# Altium project MB1605.PrjPcb (part 5 of 7)

## Sheet USB3.SchDoc: USB3
size A3; Date: Not used; ApprovedBy: Not used; CheckedBy: Not used; Author: Not used; CompanyName: STMicroelectronics; DrawnBy: Not used; Engineer: Not used; Organization: Not used; Address1: Not used; Address2: Not used; Address3: Not used; Address4: Not used; DocumentNumber: Not used; Revision: Not used; SheetNumber: 13; SheetTotal: 18; CurrentTime: Not used; CurrentDate: Not used; Time: Not used; DocumentFullPathAndName: Not used; DocumentName: Not used; ModifiedDate: Not used; ImagePath: Not used; ProjectName: Not used; Application_BuildNumber: Not used
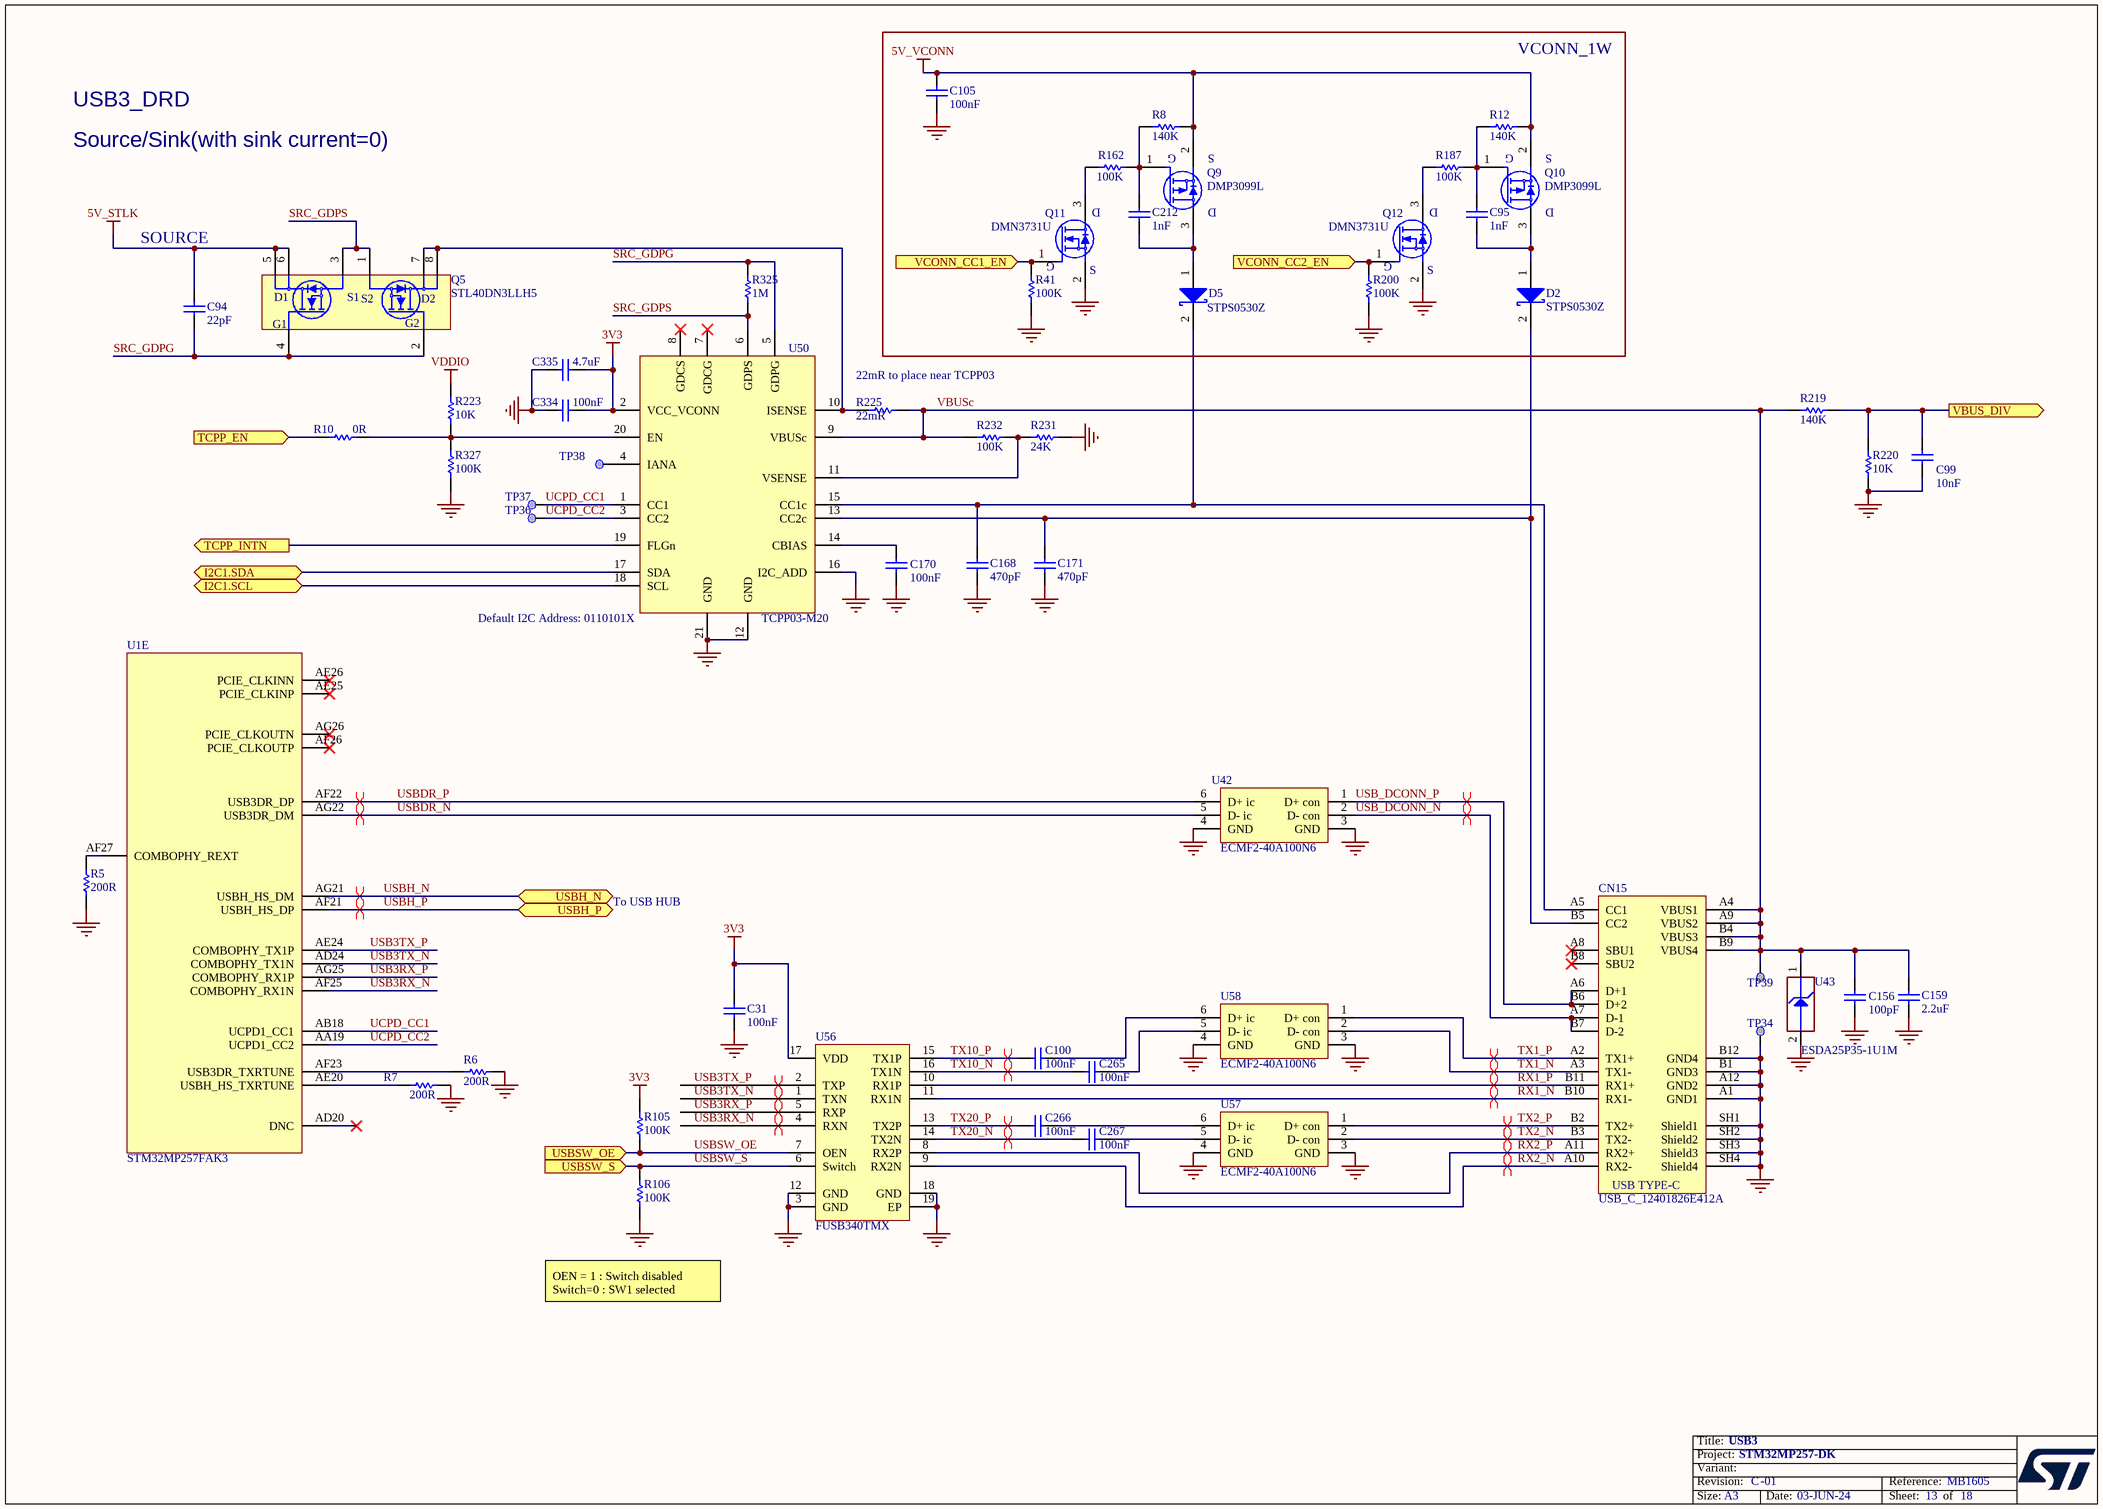
[diagram p10: USB3.SchDoc]

### Parts
C31  value 100nF  [C0402]  (hidden comment: Capacitor)
C94  value 22pF  [C0402]  (hidden comment: Capacitor)
C95  value 1nF  [C0402]  (hidden comment: Capacitor)
C99  value 10nF  [C0402]  (hidden comment: Capacitor)
C100  value 100nF  [C0201_H0P3]  (hidden comment: Capacitor)
C105  value 100nF  [C0402]  (hidden comment: Capacitor)
C156  value 100pF  [C0402]  (hidden comment: Capacitor)
C159  value 2.2uF  [C0805]  (hidden comment: Capacitor)
C168  value 470pF  [C0402]  (hidden comment: Capacitor)
C170  value 100nF  [C0603]  (hidden comment: Capacitor)
C171  value 470pF  [C0402]  (hidden comment: Capacitor)
C212  value 1nF  [C0402]  (hidden comment: Capacitor)
C265  value 100nF  [C0201_H0P3]  (hidden comment: Capacitor)
C266  value 100nF  [C0201_H0P3]  (hidden comment: Capacitor)
C267  value 100nF  [C0201_H0P3]  (hidden comment: Capacitor)
C334  value 100nF  [C0402]  (hidden comment: Capacitor)
C335  value 4.7uF  [C0402]  (hidden comment: Capacitor)
CN15  value USB_C_12401826E412A  [CON_USB-TYPEC_AMPHENOL_12401826E412A]  (hidden comment: USB_TYPE_C_Receptacle)
D2  value STPS0530Z  [DIO_SOD123_1A_2K_H1P45]  (hidden comment: SCHOTTKY_1A_2K)
D5  value STPS0530Z  [DIO_SOD123_1A_2K_H1P45]  (hidden comment: SCHOTTKY_1A_2K)
Q5  STL40DN3LLH5  [PowerFLAT_5x6]
Q9  value DMP3099L  [MOS_SOT23]  (hidden comment: MOSFET_P-CHANNEL)
Q10  value DMP3099L  [MOS_SOT23]  (hidden comment: MOSFET_P-CHANNEL)
Q11  value DMN3731U  [MOS_SOT23]  (hidden comment: MOSFET_N-CHANNEL)
Q12  value DMN3731U  [MOS_SOT23]  (hidden comment: MOSFET_N-CHANNEL)
R5  value 200R  [R0402]  (hidden comment: Resistor)
R6  value 200R  [R0402]  (hidden comment: Resistor)
R7  value 200R  [R0402]  (hidden comment: Resistor)
R8  value 140K  [R0402]  (hidden comment: Resistor)
R10  value 0R  [R0402]  (hidden comment: Resistor)
R12  value 140K  [R0402]  (hidden comment: Resistor)
R41  value 100K  [R0402]  (hidden comment: Resistor)
R105  value 100K  [R0402]  (hidden comment: Resistor)
R106  value 100K  [R0402]  (hidden comment: Resistor)
R162  value 100K  [R0402]  (hidden comment: Resistor)
R187  value 100K  [R0402]  (hidden comment: Resistor)
R200  value 100K  [R0402]  (hidden comment: Resistor)
R219  value 140K  [R0402]  (hidden comment: Resistor)
R220  value 10K  [R0402]  (hidden comment: Resistor)
R223  value 10K  [R0402]  (hidden comment: Resistor)
R225  value 22mR  [R0603]  (hidden comment: Resistor)
R231  value 24K  [R0402]  (hidden comment: Resistor)
R232  value 100K  [R0402]  (hidden comment: Resistor)
R325  value 1M  [R0402]  (hidden comment: Resistor)
R327  value 100K  [R0402]  (hidden comment: Resistor)
TP34  Test Point  [TP_SMD_1MM]  (value not drawn)  (no BOM)
TP36  Test Point  [TP_SMD_1MM]  (value not drawn)  (no BOM)
TP37  Test Point  [TP_SMD_1MM]  (value not drawn)  (no BOM)
TP38  Test Point  [TP_SMD_1MM]  (value not drawn)  (no BOM)
TP39  Test Point  [TP_SMD_1MM]  (value not drawn)  (no BOM)
U1  STM32MP257FAK3  [ICC_TFBGA424_14X14_P050_H1P20_CODE-B0A2]  (part E of 9)
U42  ECMF2-40A100N6  [ESD_UQFN-6L_1P45X1P4_P040]
U43  value ESDA25P35-1U1M  [ESD_QFN1610_2N_1K_2A]  (hidden comment: ESD-TRANSIL)
U50  TCPP03-M20  [ICC_QFN20-EPAD_4X4_P050]
U56  FUSB340TMX  [ICC_UQFN18-EPAD_2X2P80_P040]
U57  ECMF2-40A100N6  [ESD_UQFN-6L_1P45X1P4_P040]
U58  ECMF2-40A100N6  [ESD_UQFN-6L_1P45X1P4_P040]

### Blocks framed on the sheet
VCONN_1W: C95 C105 C212 D2 D5 Q9-Q12 R8 R12 R41 R162 R187 R200

### Ports
I2C1.SCL (bidir), I2C1.SDA (bidir), TCPP_EN (in), TCPP_INTN (out), USBH_N (bidir), USBH_P (bidir), USBSW_OE (in), USBSW_S (in), VBUS_DIV (out), VCONN_CC1_EN (in), VCONN_CC2_EN (in)

### Nets
3V3: C31.1 C334.1 C335.1 R105.2 U50.2(VCC_VCONN) U56.17(VDD)
5V_STLK: C94.2 Q5.5(D1) Q5.6(D1)
5V_VCONN: C105.1 Q9.2(S) Q10.2(S) R8.2 R12.2
GND: C31.2 C99.2 C105.2 C156.1 C159.1 C168.1 C170.1 C171.1 C334.2 C335.2 CN15.A1(GND1) CN15.A12(GND2) CN15.B1(GND3) CN15.B12(GND4) CN15.SH1(Shield1) CN15.SH2(Shield2) CN15.SH3(Shield3) CN15.SH4(Shield4) Q11.2(S) Q12.2(S) R5.1 R6.2 R7.2 R41.1 R106.1 R200.1 R220.1 R231.2 R327.1 TP34.1 U42.3(GND) U42.4(GND) U43.2(GND) U50.12(GND) U50.16(I2C_ADD) U50.21(GND) U56.3(GND) U56.12(GND) U56.18(GND) U56.19(EP) U57.3(GND) U57.4(GND) U58.3(GND) U58.4(GND)
VDDIO: R223.2
I2C1.SCL: U50.18(SCL) ; port I2C1.SCL
I2C1.SDA: U50.17(SDA) ; port I2C1.SDA
RX1_N: CN15.B10(RX1-) U56.11(RX1N)
RX1_P: CN15.B11(RX1+) U56.10(RX1P)
RX2_N: CN15.A10(RX2-) U56.9(RX2N)
RX2_P: CN15.A11(RX2+) U56.8(RX2P)
SRC_GDPG: C94.1 Q5.2(G2) Q5.4(G1) R325.2 U50.5(GDPG)
SRC_GDPS: Q5.1(S2) Q5.3(S1) R325.1 U50.6(GDPS)
TCPP_EN: R10.1 ; port TCPP_EN
TCPP_INTN: U50.19(FLGn) ; port TCPP_INTN
TX1_N: CN15.A3(TX1-) U58.2(D-_con)
TX1_P: CN15.A2(TX1+) U58.1(D+_con)
TX2_N: CN15.B3(TX2-) U57.2(D-_con)
TX2_P: CN15.B2(TX2+) U57.1(D+_con)
TX10_N: C265.1 U56.16(TX1N)
TX10_P: C100.1 U56.15(TX1P)
TX20_N: C267.1 U56.14(TX2N)
TX20_P: C266.1 U56.13(TX2P)
UCPD_CC1: TP37.1 U1.AB18(UCPD1_CC1) U50.1(CC1)
UCPD_CC2: TP36.1 U1.AA19(UCPD1_CC2) U50.3(CC2)
USB3RX_N: U1.AF25(COMBOPHY_RX1N) U56.4(RXN)
USB3RX_P: U1.AG25(COMBOPHY_RX1P) U56.5(RXP)
USB3TX_N: U1.AD24(COMBOPHY_TX1N) U56.1(TXN)
USB3TX_P: U1.AE24(COMBOPHY_TX1P) U56.2(TXP)
USB_DCONN_N: CN15.A7(D-1) CN15.B7(D-2) U42.2(D-_con)
USB_DCONN_P: CN15.A6(D+1) CN15.B6(D+2) U42.1(D+_con)
USBDR_N: U1.AG22(USB3DR_DM) U42.5(D-_ic)
USBDR_P: U1.AF22(USB3DR_DP) U42.6(D+_ic)
USBH_N: U1.AG21(USBH_HS_DM) ; port USBH_N
USBH_P: U1.AF21(USBH_HS_DP) ; port USBH_P
USBSW_OE: R105.1 U56.7(OEN) ; port USBSW_OE
USBSW_S: R106.2 U56.6(Switch) ; port USBSW_S
VBUS_DIV: C99.1 R219.1 R220.2 ; port VBUS_DIV
VBUSc: C156.2 C159.2 CN15.A4(VBUS1) CN15.A9(VBUS2) CN15.B4(VBUS3) CN15.B9(VBUS4) R219.2 R225.1 R232.1 TP39.1 U43.1(IO1) U50.9(VBUSc)
VCONN_CC1_EN: Q11.1(G) R41.2 ; port VCONN_CC1_EN
VCONN_CC2_EN: Q12.1(G) R200.2 ; port VCONN_CC2_EN
NetC95_1: C95.1 D2.1(A) Q10.3(D)
NetC95_2: C95.2 Q10.1(G) R12.1 R187.2
NetC100_2: C100.2 U58.6(D+_ic)
NetC168_2: C168.2 CN15.A5(CC1) D5.2(K) U50.15(CC1c)
NetC170_2: C170.2 U50.14(CBIAS)
NetC171_2: C171.2 CN15.B5(CC2) D2.2(K) U50.13(CC2c)
NetC212_1: C212.1 D5.1(A) Q9.3(D)
NetC212_2: C212.2 Q9.1(G) R8.1 R162.2
NetC265_2: C265.2 U58.5(D-_ic)
NetC266_2: C266.2 U57.6(D+_ic)
NetC267_2: C267.2 U57.5(D-_ic)
NetQ5_7: Q5.7(D2) Q5.8(D2) R225.2 U50.10(ISENSE)
NetQ11_3: Q11.3(D) R162.1
NetQ12_3: Q12.3(D) R187.1
NetR5_2: R5.2 U1.AF27(COMBOPHY_REXT)
NetR6_1: R6.1 U1.AF23(USB3DR_TXRTUNE)
NetR7_1: R7.1 U1.AE20(USBH_HS_TXRTUNE)
NetR10_2: R10.2 R223.1 R327.2 U50.20(EN)
NetR231_1: R231.1 R232.2 U50.11(VSENSE)
NetTP38_1: TP38.1 U50.4(IANA)

Not connected (* = marked no-connect by the designer): CN15 A8(SBU1)* B8(SBU2)*; U1 AD20(DNC)* AE25(PCIE_CLKINP)* AE26(PCIE_CLKINN)* AF26(PCIE_CLKOUTP)* AG26(PCIE_CLKOUTN)*; U50 7(GDCG)* 8(GDCS)*

### Layout directives
differential pair: RX1_N, RX1_P, RX2_N, RX2_P, TX1_N, TX1_P, TX2_N, TX2_P, TX10_N, TX10_P, TX20_N, TX20_P, USB3RX_N, USB3RX_P, USB3TX_N, USB3TX_P, USB_DCONN_N, USB_DCONN_P, USBDR_N, USBDR_P, USBH_N, USBH_P

### Notes on the sheet
- USB3_DRD
- Source/Sink(with sink current=0)
- SOURCE
- 22mR to place near TCPP03
- (near U50) Default I2C Address: 0110101X
- To USB HUB
- OEN = 1 : Switch disabled
  Switch=0 : SW1 selected
- Title:
- Project:
- Size:
- Revision:
- Variant:
- A3
- -
- Date:
- Reference:
- Sheet:
- of
- (in symbol MCD-03232) USB TYPE-C

### Library data of the parts
C31 C105 C334 = MCD-00006: Capacitor, MLCC, 100nF, 16V, X7R, +/-10%, 0402, T=0.5mm; Part_Preference: Recommended; Manufacturer: YAGEO; Manufacturer_Part_Number: CC0402KRX7R7BB104; Partial_Alternate_Internal_Part_Number: MCD-03299; Order_Code_RS: 616-9701; Component_Country_Of_Origin: China; Alternate_EMS: M; ID: 2474; ShowFields: YES; Internal_Part_Number: MCD-00006; Status: Released; Part_Type: Capacitor; Package: 0402; ComponentLink1URL: http://tunmcdsvn.tun.st.com/Component_Documentation_Library/Trunk/Capacitor/YAGEO_X7R_Series; Order_Code_Digikey: 311-1338-1-ND; Order_Code_Farnell: 9402047
C94 = MCD-01995: Capacitor, MLCC, 22pF, 50V, C0G, +/-5%, 0402, T=0.5mm; Part_Preference: Recommended; Manufacturer: TDK; Manufacturer_Part_Number: C1005NP01H220J050BA; Component_Country_Of_Origin: Unknown; ID: 4095; ShowFields: YES; Internal_Part_Number: MCD-01995; Status: Released; Part_Type: Capacitor; Package: 0402; ComponentLink1URL: http://tunmcdsvn.tun.st.com/Component_Documentation_Library/Trunk/Capacitor/TDK_C_Series; Order_Code_Digikey: 445-13793-1-ND; Order_Code_Farnell: 3416050RL; Order_Code_RS: N/A
C95 C212 = MCD-00198: Capacitor, MLCC, 1nF, 16V, X7R, +/-10%, 0402, T=0.5mm; Part_Preference: Recommended; Manufacturer: YAGEO; Manufacturer_Part_Number: CC0402KRX7R7BB102; Component_Country_Of_Origin: China; ShowFields: YES; ID: 2665; Internal_Part_Number: MCD-00198; Status: Released; Part_Type: Capacitor; Package: 0402; ComponentLink1URL: http://tunmcdsvn.tun.st.com/Component_Documentation_Library/Trunk/Capacitor/YAGEO_X7R_Series; Order_Code_Digikey: 311-1352-1-ND; Order_Code_Farnell: 2370642; Order_Code_RS: N/A
C99 = MCD-00011: Capacitor, MLCC, 10nF, 16V, X7R, 10%, 0402, T=0.5mm; Manufacturer_Part_Number: CC0402KRX7R7BB103; Manufacturer: YAGEO; Part_Preference: Recommended; Provided_By: SUBCO; Initial_Board_Reference: MB1274; Order_Code_RS: 669-8688; Internal_Part_Number: MCD-00011; Status: Released; Part_Type: Capacitor; Package: 0402; ComponentLink1Description: Datasheet; ComponentLink1URL: http://tunmcdsvn.tun.st.com/Component_Documentation_Library/Trunk/Capacitor/YAGEO_X7R_Series; ECCN_US: n/a; ECCN_EU: n/a; Alternate_Manufacturer: N/A; Alternate_Manufacturer_Part_Number: N/A; Order_Code_Digikey: 311-1042-1-ND; Order_Code_Farnell: 3019275
C100 C265-C267 = MCD-00697: Capacitor, MLCC, 100nF,10V, X5R, +/-10%, 0201, T=0.3mm; Part_Preference: Recommended; Manufacturer: TDK; Manufacturer_Part_Number: C0603X5R1A104K030BC; Component_Country_Of_Origin: Unknown; ID: 3046; ShowFields: YES; Internal_Part_Number: MCD-00697; Status: Released; Part_Type: Capacitor; Alternate_Manufacturer: N/A; Alternate_Manufacturer_Part_Number: N/A; Package: 0201; ComponentLink1URL: http://tunmcdsvn.tun.st.com/Component_Documentation_Library/Trunk/Capacitor/TDK_MCC_Series; Order_Code_Digikey: 445-7318-1-ND; Order_Code_Farnell: 2524957; Order_Code_RS: N/A
C156 = MCD-00205: Capacitor, MLCC, 100pF, 50V, NPO, +/-5%, 0402, T=0.5mm; Manufacturer_Part_Number: CC0402JRNPO9BN101; Manufacturer: YAGEO; Part_Preference: Recommended; Component_Country_Of_Origin: China; ID: 2658; ShowFields: YES; Internal_Part_Number: MCD-00205; Status: Released; Part_Type: Capacitor; Package: 0402; ComponentLink1URL: http://tunmcdsvn.tun.st.com/Component_Documentation_Library/Trunk/Capacitor/YAGEO_NP0_Series; Order_Code_Digikey: 311-1024-1-ND; Order_Code_Farnell: 3019226RL; Order_Code_RS: N/A
C159 = MCD-02372: Capacitor, MLCC, 2.2uF, 25V, X7R, +/-10%, 0805, T=1,25mm; Part_Preference: Recommended; Manufacturer: MURATA; Manufacturer_Part_Number: GRM21BR71E225KE11L; Component_Country_Of_Origin: Japan; ID: 4478; ShowFields: YES; Internal_Part_Number: MCD-02372; Status: Released; Part_Type: Capacitor; Package: 0805; ComponentLink1URL: http://tunmcdsvn.tun.st.com/Component_Documentation_Library/Trunk/Capacitor/MURATA_GRM_Series/GRM21BR71E225KE11; Order_Code_Digikey: 490-14467; Order_Code_Farnell: 2688538; Order_Code_RS: N/A
C168 C171 = MCD-00724: Capacitor, MLCC, 470pF, 50V, NPO, +/-5%, 0402, T=0.5mm; Manufacturer_Part_Number: CC0402JRNPO9BN471; Manufacturer: YAGEO; Part_Preference: Recommended; Component_Country_Of_Origin: China; Order_Code_RS: 199-2186; ID: 3023; ShowFields: YES; Internal_Part_Number: MCD-00724; Status: Released; Part_Type: Capacitor; Package: 0402; ComponentLink1URL: http://tunmcdsvn.tun.st.com/Component_Documentation_Library/Trunk/Capacitor/YAGEO_NP0_Series; Order_Code_Digikey: 311-1671-1-ND; Order_Code_Farnell: 3366416
C170 = MCD-01099: Capacitor, MLCC, 100nF, 50V, X7R, +/-10%, 0603, T=0.8mm; BMS_Part_Number: 9142278; Part_Preference: Recommended; Manufacturer: YAGEO; Manufacturer_Part_Number: CC0603KRX7R9BB104; Order_Code_RS: 669-8767; Component_Country_Of_Origin: China; ID: 3397; ShowFields: YES; Internal_Part_Number: MCD-01099; Status: Released; Part_Type: Capacitor; Package: 0603; ComponentLink1URL: http://tunmcdsvn.tun.st.com/Component_Documentation_Library/Trunk/Capacitor/YAGEO_X7R_Series; Order_Code_Digikey: 311-1344-1-ND; Order_Code_Farnell: 1362556; Partial_Alternate_Internal_Part_Number: MCD-0211
C335 = MCD-01356: Capacitor, MLCC, 4.7uF, 6V3, X5R, +/-20%, 0402, T=0.5mm; Part_Preference: Recommended; Manufacturer: MURATA; Manufacturer_Part_Number: GRM155R60J475ME47; Order_Code_RS: 814-5230; Component_Country_Of_Origin: Japan; ID: 3456; ShowFields: YES; Internal_Part_Number: MCD-01356; Status: Released; Part_Type: Capacitor; Package: 0402; ComponentLink1URL: http://tunmcdsvn.tun.st.com/Component_Documentation_Library/Trunk/Capacitor/MURATA_GRM_Series; Order_Code_Digikey: 490-5915-1-ND; Order_Code_Farnell: 2666407
CN15 = MCD-03232: USB_TypeC, 24 pins, RA, SMD, T=2.96mm (USB Certified 3.1); Part_Type: Connector; Part_Preference: Recommended; Manufacturer: AMPHENOL ICC; Manufacturer_Part_Number: 12401826E412A; Component_Country_Of_Origin: China°; ShowFields: YES; ID: 5348; Internal_Part_Number: MCD-03232; Status: Checked; ComponentLink1URL: http://tunmcdsvn.tun.st.com/Component_Documentation_Library/Trunk/Connector/AMPHEMOL_ICC_12401826E412A; Order_Code_Digikey: 12401826E412ATR-ND; Order_Code_Farnell: 3727763; Order_Code_RS: N/A
D2 D5 = MCD-03688: Diode, Schottky, 0V33, 0.5A , 30V, SOD123; Part_Preference: Recommended; Manufacturer: STMICROELECTRONICS; ShowFields: YES; ID: 5804; Internal_Part_Number: MCD-03688; Status: New; Part_Type: Diode; Manufacturer_Part_Number: STPS0530Z; Package: SOD123; ComponentLink1URL: http://tunmcdsvn.tun.st.com/Component_Documentation_Library/Trunk/Diode/STMICROELECTRONICS_STPS0530Z; Order_Code_Digikey: 497-16204-2-ND; Order_Code_Farnell: N/A; Order_Code_RS: N/A
Q5 = MCD-02152: MOSFET, Dual N-channel 30 V, 0.016 Ω typ., 40 A, STripFET™ H5 Power MOSFET; Part_Preference: Recommended; Part_Type: Transistor; Manufacturer: STMICROELECTRONICS; Manufacturer_HQ_COO: EU; Component_Country_Of_Origin: China; ID: 4252; ShowFields: YES; Internal_Part_Number: MCD-02152; Value: STL40DN3LLH5; Status: Released; Manufacturer_Part_Number: STL40DN3LLH5; Package: PowerFLAT 5x6; ComponentLink1URL: http://tunmcdsvn.tun.st.com/Component_Documentation_Library/Trunk/Transistor/STMICROELECTRONICS_STL40DN3LLH5; Order_Code_Digikey: N/A; Order_Code_Farnell: N/A; Order_Code_RS: N/A
Q9 Q10 = MCD-03690: Transistor, MOSFET, P-CH, 30V, 3.8A, SOT23; Part_Preference: Recommended; Manufacturer: DIODES INCORPORATED; ShowFields: YES; ID: 5806; Internal_Part_Number: MCD-03690; Status: New; Part_Type: Transistor; Manufacturer_Part_Number: DMP3099L; Package: SOT23; ComponentLink1URL: http://tunmcdsvn.tun.st.com/Component_Documentation_Library/Trunk/Transistor/DIODES_INCORPORATED_DMP3099L; Order_Code_Digikey: DMP3099L-13DITR-ND; Order_Code_Farnell: N/A; Order_Code_RS: N/A
Q11 Q12 = MCD-03691: Transistor, MOSFET, N-CH, 30V, 0.9A, SOT23; Part_Preference: Recommended; Manufacturer: DIODES INCORPORATED; Order_Code_RS: 206-0087; ShowFields: YES; ID: 5807; Internal_Part_Number: MCD-03691; Status: New; Part_Type: Transistor; Manufacturer_Part_Number: DMN3731U; ComponentLink1URL: http://tunmcdsvn.tun.st.com/Component_Documentation_Library/Trunk/Transistor/DIODES_INCORPORATED_DMN3731U; Order_Code_Digikey: 31-DMN3731U-7TR-ND; Order_Code_Farnell: 3943613
R5-R7 = MCD-00417: Resistor, 200R, 0402, +/-1%, 1/16W; Part_Preference: Recommended; Manufacturer: YAGEO; Manufacturer_Part_Number: RC0402FR-07200RL; Component_Country_Of_Origin: China; ID: 2860; ShowFields: YES; Internal_Part_Number: MCD-00417; Status: Released; Part_Type: Resistor; Package: 0402; ComponentLink1URL: http://tunmcdsvn.tun.st.com/Component_Documentation_Library/Trunk/Resistor/YAGEO_RC_L_Series; Order_Code_Digikey: 311-200LRCT-ND; Order_Code_Farnell: 1458756; Order_Code_RS: N/A
R8 R12 = MCD-02335: Resistor, 140K, 0402, +/-1%, 1/16W; Part_Preference: Recommended; Manufacturer: YAGEO; Manufacturer_Part_Number: RC0402FR-07140KL; Component_Country_Of_Origin: China; ShowFields: YES; ID: 4441; Internal_Part_Number: MCD-02335; Status: Checked; Part_Type: Resistor; Package: 0402; ComponentLink1URL: http://tunmcdsvn.tun.st.com/Component_Documentation_Library/Trunk/Resistor/YAGEO_RC_L_Series; Order_Code_Digikey: YAG2978CT-ND; Order_Code_Farnell: N/A; Order_Code_RS: N/A
R10 = MCD-00052: Resistor,0R,0402,5%,1/16W; Manufacturer_Part_Number: RC0402JR-070RL; Manufacturer: YAGEO; Part_Preference: Recommended; Order_Code_RS: 618-5804; Component_Country_Of_Origin: China; ID: 2540; ShowFields: YES; Internal_Part_Number: MCD-00052; Status: Released; Part_Type: Resistor; ComponentLink1Description: Part_Information; ComponentLink1URL: http://tunmcdsvn.tun.st.com/Component_Documentation_Library/Trunk/Resistor/YAGEO_RC_L_Series; Package: 0402; Order_Code_Digikey: 311-0.0JRCT-ND; Order_Code_Farnell: 9232516RL; Alternate_Manufacturer: N/A; Alternate_Manufacturer_Part_Number: N/A
R41 R162 R187 R200 = MCD-00059: Resistor, 100K, 0402, +/-1%, 1/16W; Part_Preference: Recommended; Manufacturer: YAGEO; Manufacturer_Part_Number: RC0402FR-07100KL; Partial_Alternate_Internal_Part_Number: MCD-03301; Component_Country_Of_Origin: China; Alternate_EMS: M; ShowFields: YES; ID: 2533; Internal_Part_Number: MCD-00059; Status: Released; Part_Type: Resistor; Package: 0402; ComponentLink1URL: http://tunmcdsvn.tun.st.com/Component_Documentation_Library/Trunk/Resistor/YAGEO_RC_L_Series; Order_Code_Digikey: 311-100KLRTR-ND; Order_Code_Farnell: 2421891; Order_Code_RS: N/A
R105 R106 = MCD-00059: Resistor,100K,0402,1%,1/16W; Part_Preference: Recommended; Manufacturer: YAGEO; Manufacturer_Part_Number: RC0402FR-07100KL; Alternate_Manufacturer_Part_Number: RT0402FRE07100KL; Partial_Alternate_Internal_Part_Number: MCD-03301; Alternate_EMS: M; Component_Country_Of_Origin: China; ID: 2533; ShowFields: YES; Internal_Part_Number: MCD-00059; Status: Released; Part_Type: Resistor; Alternate_Manufacturer: YAGEO; Package: 0402; ComponentLink1Description: Datasheet; ComponentLink1URL: http://tunmcdsvn.tun.st.com/Component_Documentation_Library/Trunk/Resistor/YAGEO_RC_L_Series; Order_Code_Digikey: 311-100KLRTR-ND; Order_Code_Farnell: 2421891; Order_Code_RS: N/A
R219 = MCD-02335: Resistor, 140K, 0402, +/-1%, 1/16W; Part_Preference: Recommended; Manufacturer: YAGEO; Manufacturer_Part_Number: RC0402FR-07140KL; Component_Country_Of_Origin: China; ID: 4441; ShowFields: YES; Internal_Part_Number: MCD-02335; Status: Checked; Part_Type: Resistor; Package: 0402; ComponentLink1URL: http://tunmcdsvn.tun.st.com/Component_Documentation_Library/Trunk/Resistor/YAGEO_RC_L_Series; Order_Code_Digikey: YAG2978CT-ND; Order_Code_Farnell: N/A; Order_Code_RS: N/A
R220 R223 = MCD-00053: Resistor, 10K, 0402, +/-1%, 1/16W; BMS_Part_Number: 9131590; Part_Preference: Recommended; Manufacturer: YAGEO; Manufacturer_Part_Number: RC0402FR-0710KL; Component_Country_Of_Origin: China; ID: 2539; ShowFields: YES; Internal_Part_Number: MCD-00053; Status: Released; Part_Type: Resistor; Package: 0402; ComponentLink1URL: http://tunmcdsvn.tun.st.com/Component_Documentation_Library/Trunk/Resistor/YAGEO_RC_L_Series; Order_Code_Digikey: 311-10.0KLRCT-ND; Order_Code_Farnell: 9239359; Order_Code_RS: N/A
R225 = MCD-02232: Resistor, 22mR, 0603, +/-1%, 1/3W; Part_Preference: Recommended; Manufacturer: PANASONIC; Manufacturer_Part_Number: ERJ-3BWFR022V; Order_Code_RS: 763-8671P; Component_Country_Of_Origin: Japan; ID: 4332; ShowFields: YES; Internal_Part_Number: MCD-02232; Status: Checked; Part_Type: Resistor; Package: 0603; ComponentLink1URL: http://tunmcdsvn.tun.st.com/Component_Documentation_Library/Trunk/Resistor/PANASONIC_ERJ_Series; Order_Code_Digikey: P17462CT-ND; Order_Code_Farnell: 1798578
R231 = MCD-00435: Resistor, 24K, 0402, +/-1%, 1/16W; Part_Preference: Recommended; Manufacturer: YAGEO; Manufacturer_Part_Number: RC0402FR-0724KL; Component_Country_Of_Origin: China; ShowFields: YES; ID: 2845; Internal_Part_Number: MCD-00435; Status: Released; Part_Type: Resistor; Package: 0402; ComponentLink1URL: http://tunmcdsvn.tun.st.com/Component_Documentation_Library/Trunk/Resistor/YAGEO_RC_L_Series; Order_Code_Digikey: 311-24KLRCT-ND; Order_Code_Farnell: N/A; Order_Code_RS: N/A
R232 R327 = MCD-02265: Resistor,100K,0402,0.5%,1/16W; Part_Preference: Recommended; Manufacturer: YAGEO; Manufacturer_Part_Number: RC0402DR-07100KL; Component_Country_Of_Origin: China; ShowFields: YES; ID: 4365; Internal_Part_Number: MCD-02265; Status: Released; Part_Type: Resistor; Package: 0402; Order_Code_Digikey: 13-RC0402DR-07100KLTR-ND; Order_Code_Farnell: N/A; Order_Code_RS: N/A
  R232: ComponentLink1URL: http://tunmcdsvn.tun.st.com/Component_Documentation_Library/Trunk/Resistor/YAGEO_RC0402_Series
  R327: ComponentLink1URL: http://tunmcdsvn.tun.st.com/Component_Datasheet_Library/Trunk/Resistors/Yageo_Resistor_RC0402-series
R325 = MCD-00182: Resistor, 1M, 0402, +/-1%, 1/16W; BMS_Part_Number: 9131778; Part_Preference: Recommended; Manufacturer: YAGEO; Manufacturer_Part_Number: RC0402FR-071ML; Order_Code_RS: 618-6194; Component_Country_Of_Origin: China; ShowFields: YES; ID: 2686; Internal_Part_Number: MCD-00182; Status: Released; Part_Type: Resistor; Package: 0402; ComponentLink1URL: http://tunmcdsvn.tun.st.com/Component_Documentation_Library/Trunk/Resistor/YAGEO_RC_L_Series; Order_Code_Digikey: 311-1.00MLRCT-ND; Order_Code_Farnell: 9239588
TP34 TP36-TP39 = MCD-00074: Test Point 1mm; Part_Type: Misc; Part_Preference: Recommended; ID: 2518; ShowFields: YES; Internal_Part_Number: MCD-00074; Status: Released; Manufacturer_Part_Number: n/a; Manufacturer: N/A; ComponentLink1URL: http://na; Order_Code_Digikey: N/A; Order_Code_Farnell: N/A; Order_Code_RS: N/A
U1 = MCD-03375: MPU , 2xCortex-A35@1.5GHz, Cortex-M33@400MHz, TFBGA 14x14, pitch 0.5, 648KB SRAM, With Crypto; Part_Type: IC; Part_Preference: Recommended; Manufacturer: STMICROELECTRONICS; Component_Country_Of_Origin: Unknown; ShowFields: YES; ID: 5491; Value: STM32MP257FAK3; Internal_Part_Number: MCD-03375; Status: Checked; Manufacturer_Part_Number: STM32MP257FAK3; Package: TFBGA; ComponentLink1URL: http://tunmcdsvn.tun.st.com/Component_Documentation_Library/Trunk/IC/STMICROELECTRONICS_STM32MP257FAK3; Order_Code_Digikey: N/A; Order_Code_Farnell: N/A; Order_Code_RS: N/A
U42 = MCD-03060: ESD protection & Common Filter High Speed serial Interfaces , 0.4 pitch; Part_Type: IC; Part_Preference: Recommended; Manufacturer: STMICROELECTRONICS; ShowFields: YES; ID: 5176; Component_Country_Of_Origin: China; ComponentLink1Description: Datasheet; ComponentLink1URL: http://tunmcdsvn.tun.st.com/Component_Documentation_Library/Trunk/IC/STMICROELECTRONICS_ECMF4-40A100N10; Internal_Part_Number: MCD-03060; Value: ECMF2-40A100N6; Status: Checked; Manufacturer_Part_Number: ECMF2-40A100N6; Package: uQFN-6; Order_Code_Digikey: 497-ECMF2-40A100N6; Order_Code_Farnell: 3993603; Order_Code_RS: N/A
U43 = MCD-01207: High power Transient voltage suppressor:25V/35A EOS and ESD transients protection.; BMS_Part_Number: 9179045; Part_Type: Diode; Part_Preference: Recommended; Manufacturer: STMICROELECTRONICS; Manufacturer_HQ_COO: EU; Component_Country_Of_Origin: China; ID: 3289; ShowFields: YES; Internal_Part_Number: MCD-01207; Status: Released; Manufacturer_Part_Number: ESDA25P35-1U1M; Package: QFN1610; ComponentLink1URL: http://tunmcdsvn.tun.st.com/Component_Documentation_Library/Trunk/Diode/STMICROELECTRONICS_ESDA25P35-1U1M; Order_Code_Digikey: N/A; Order_Code_Farnell: N/A; Order_Code_RS: N/A
U50 = MCD-02130: USB Type-C Port Protection for USB DRP Power Delivery, PPS compliant; Part_Preference: Recommended; Part_Type: IC; Manufacturer: STMICROELECTRONICS; Manufacturer_HQ_COO: EU; Component_Country_Of_Origin: Unknown; ID: 4230; ShowFields: YES; Internal_Part_Number: MCD-02130; Value: TCPP03-M20; Status: Released; Manufacturer_Part_Number: TCPP03-M20; Package: QFN-20L; ComponentLink1URL: http://tunmcdsvn.tun.st.com/Component_Documentation_Library/Trunk/IC/STMICROELECTRONICS_TCPP03-M20; Order_Code_Digikey: N/A; Order_Code_Farnell: N/A; Order_Code_RS: N/A
U56 = MCD-02300: Switch USB3.1 Superspeed 10 Gbps , Gen1 and Gen2; Part_Type: IC; Part_Preference: Recommended; Manufacturer: ON SEMICONDUCTOR; Component_Country_Of_Origin: Thailand; ID: 4400; ShowFields: YES; Internal_Part_Number: MCD-02300; Value: FUSB340TMX; Status: Checked; Manufacturer_Part_Number: FUSB340TMX; Alternate_Manufacturer: N/A; Alternate_Manufacturer_Part_Number: N/A; Package: QFN; ComponentLink1URL: http://tunmcdsvn.tun.st.com/Component_Documentation_Library/Trunk/IC/ON_SEMICONDUCTOR_FUSB340TMX; Order_Code_Digikey: FUSB340TMXTR-ND; Order_Code_Farnell: 3360109; Order_Code_RS: N/A
U57 U58 = MCD-03060: IC, ESD protection and Common Filter High Speed serial Interfaces, 10.7 GHz; Part_Preference: Recommended; Manufacturer: STMICROELECTRONICS; Component_Country_Of_Origin: China; ShowFields: YES; ID: 5176; ComponentLink1Description: Datasheet; ComponentLink1URL: http://tunmcdsvn.tun.st.com/Component_Documentation_Library/Trunk/IC/STMICROELECTRONICS_ECMF4-40A100N10; Internal_Part_Number: MCD-03060; Value: ECMF2-40A100N6; Status: Released; Part_Type: IC; Manufacturer_Part_Number: ECMF2-40A100N6; Package: uQFN-6; Order_Code_Digikey: 497-ECMF2-40A100N6; Order_Code_Farnell: 3993603; Order_Code_RS: N/A

## Sheet CAMERA.SchDoc: CAMERA
size A4; Date: Not used; ApprovedBy: Not used; CheckedBy: Not used; Author: Not used; CompanyName: STMicroelectronics; DrawnBy: Not used; Engineer: Not used; Organization: Not used; Address1: Not used; Address2: Not used; Address3: Not used; Address4: Not used; DocumentNumber: Not used; Revision: Not used; SheetNumber: 11; SheetTotal: 18; CurrentTime: Not used; CurrentDate: Not used; Time: Not used; DocumentFullPathAndName: Not used; DocumentName: Not used; ModifiedDate: Not used; ImagePath: Not used; ProjectName: Not used; Application_BuildNumber: Not used
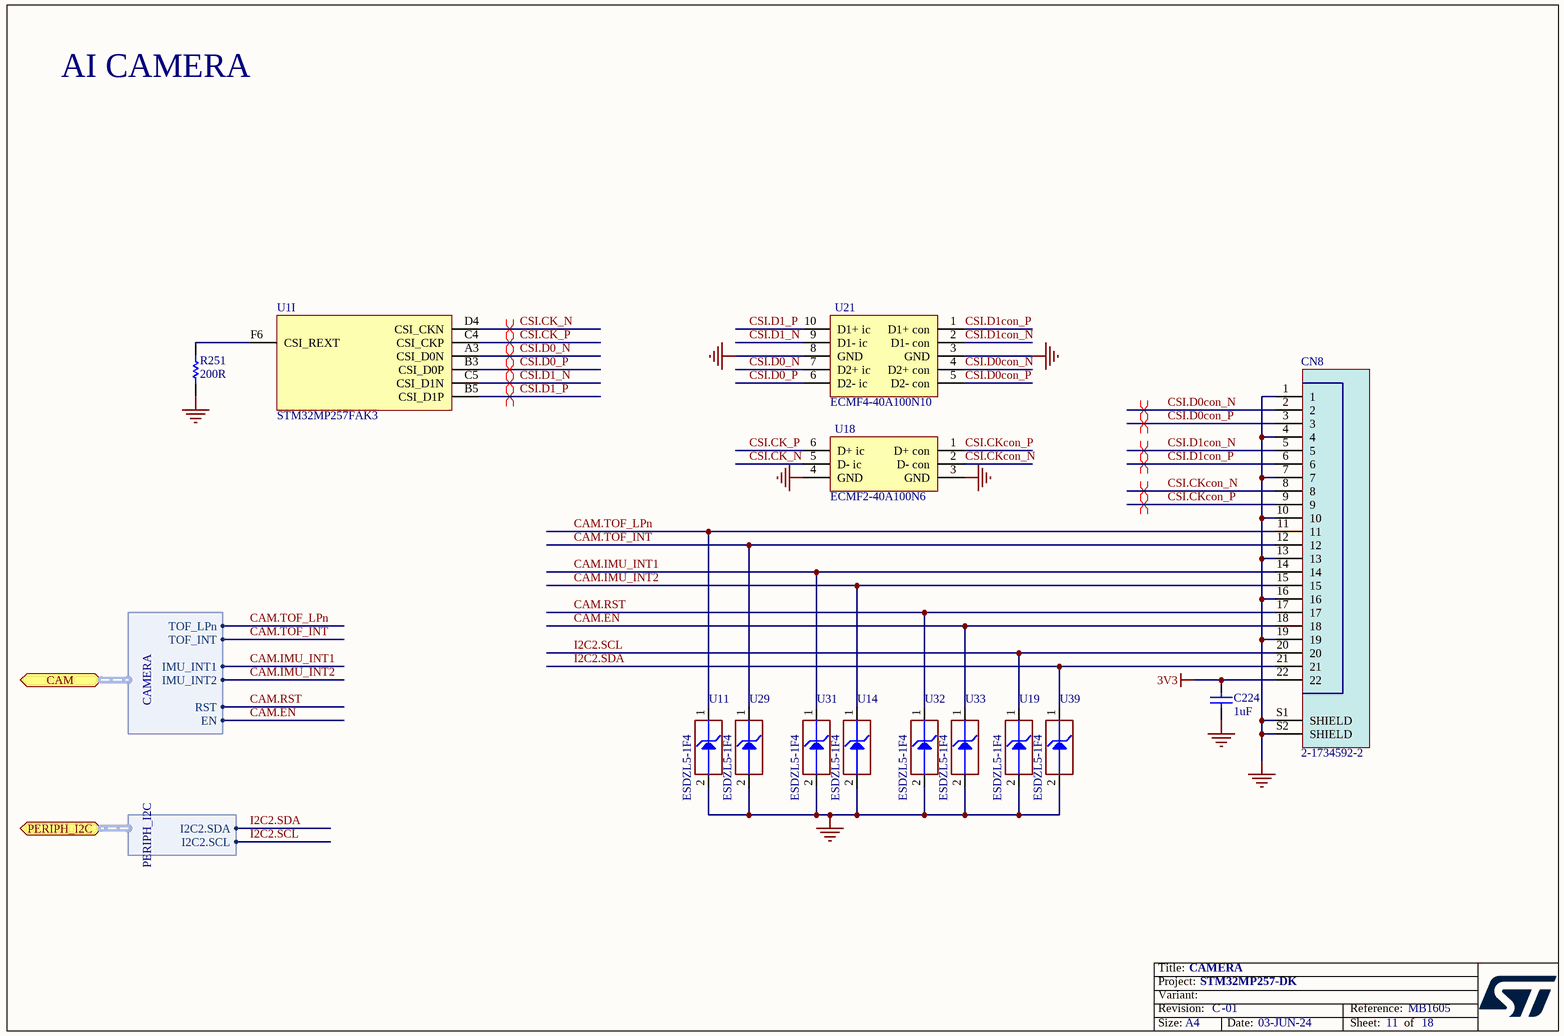
[diagram p11: CAMERA.SchDoc]

### Parts
C224  value 1uF  [C0402]  (hidden comment: Capacitor)
CN8  2-1734592-2  [CON_TE-CONNECTIVITY_2-1734592-2_INV]
R251  value 200R  [R0402]  (hidden comment: Resistor)
U1  STM32MP257FAK3  [ICC_TFBGA424_14X14_P050_H1P20_CODE-B0A2]  (part I of 9)
U11  value ESDZL5-1F4  [ESD_ST0201]  (hidden comment: ESD-TRANSIL)
U14  value ESDZL5-1F4  [ESD_ST0201]  (hidden comment: ESD-TRANSIL)
U18  ECMF2-40A100N6  [ESD_UQFN-6L_1P45X1P4_P040]
U19  value ESDZL5-1F4  [ESD_ST0201]  (hidden comment: ESD-TRANSIL)
U21  ECMF4-40A100N10  [ESD_UQFN-10L_2P25X1P4_P040]
U29  value ESDZL5-1F4  [ESD_ST0201]  (hidden comment: ESD-TRANSIL)
U31  value ESDZL5-1F4  [ESD_ST0201]  (hidden comment: ESD-TRANSIL)
U32  value ESDZL5-1F4  [ESD_ST0201]  (hidden comment: ESD-TRANSIL)
U33  value ESDZL5-1F4  [ESD_ST0201]  (hidden comment: ESD-TRANSIL)
U39  value ESDZL5-1F4  [ESD_ST0201]  (hidden comment: ESD-TRANSIL)

### Ports
CAM (bidir, harness CAMERA), PERIPH_I2C (bidir, harness PERIPH_I2C)

### Harnesses
PERIPH_I2C: I2C2.SDA, I2C2.SCL
CAMERA: TOF_LPn, TOF_INT, IMU_INT1, IMU_INT2, RST, EN

### Nets
3V3: C224.2 CN8.22
GND: C224.1 CN8.1 CN8.4 CN8.7 CN8.10 CN8.13 CN8.16 CN8.19 CN8.S1(SHIELD) CN8.S2(SHIELD) R251.2 U11.2(GND) U14.2(GND) U18.3(GND) U18.4(GND) U19.2(GND) U21.3(GND) U21.8(GND) U29.2(GND) U31.2(GND) U32.2(GND) U33.2(GND) U39.2(GND)
CAM.EN: CN8.18 U33.1(IO1) ; port CAM.EN
CAM.IMU_INT1: CN8.14 U31.1(IO1) ; port CAM.IMU_INT1
CAM.IMU_INT2: CN8.15 U14.1(IO1) ; port CAM.IMU_INT2
CAM.RST: CN8.17 U32.1(IO1) ; port CAM.RST
CAM.TOF_INT: CN8.12 U29.1(IO1) ; port CAM.TOF_INT
CAM.TOF_LPn: CN8.11 U11.1(IO1) ; port CAM.TOF_LPn
CSI.CK_N: U1.D4(CSI_CKN) U18.5(D-_ic)
CSI.CK_P: U1.C4(CSI_CKP) U18.6(D+_ic)
CSI.CKcon_N: CN8.8 U18.2(D-_con)
CSI.CKcon_P: CN8.9 U18.1(D+_con)
CSI.D0_N: U1.A3(CSI_D0N) U21.7(D2+_ic)
CSI.D0_P: U1.B3(CSI_D0P) U21.6(D2-_ic)
CSI.D0con_N: CN8.2 U21.4(D2+_con)
CSI.D0con_P: CN8.3 U21.5(D2-_con)
CSI.D1_N: U1.C5(CSI_D1N) U21.9(D1-_ic)
CSI.D1_P: U1.B5(CSI_D1P) U21.10(D1+_ic)
CSI.D1con_N: CN8.5 U21.2(D1-_con)
CSI.D1con_P: CN8.6 U21.1(D1+_con)
I2C2.SCL: CN8.20 U19.1(IO1) ; port PERIPH_I2C.I2C2.SCL
I2C2.SDA: CN8.21 U39.1(IO1) ; port PERIPH_I2C.I2C2.SDA
NetR251_1: R251.1 U1.F6(CSI_REXT)

### Layout directives
differential pair: CSI.CK_N, CSI.CK_P, CSI.CKcon_N, CSI.CKcon_P, CSI.D0_N, CSI.D0_P, CSI.D0con_N, CSI.D0con_P, CSI.D1_N, CSI.D1_P, CSI.D1con_N, CSI.D1con_P

### Notes on the sheet
- AI CAMERA
- Title:
- Project:
- Size:
- Revision:
- Variant:
- A4
- -
- Date:
- Reference:
- Sheet:
- of

### Library data of the parts
C224 = MCD-00095: Capacitor, MLCC, 1uF, 25V, X5R, +/-10%, 0402, T=0,5mm; Manufacturer_Part_Number: GRM155R61E105KA12; Manufacturer: MURATA; Part_Preference: Recommended; Alternate_Manufacturer_Part_Number: GRM155R60J105KE19; Order_Code_RS: 846-7287; Component_Country_Of_Origin: Japan; ID: 2772; ShowFields: YES; Internal_Part_Number: MCD-00095; Status: Released; Part_Type: Capacitor; Package: 0402; ComponentLink1Description: Datasheet; ComponentLink1URL: http://tunmcdsvn.tun.st.com/Component_Documentation_Library/Trunk/Capacitor/MURATA_GRM_Series; Order_Code_Digikey: 490-10017-1-ND; Order_Code_Farnell: 2218855; Alternate_Manufacturer: MURATA
CN8 = MCD-03600: Socket_FFC/FPC, 22pins, 0.5mm, RA, SMD, T=2mm; Part_Type: Connector; Part_Preference: Recommended; Manufacturer: TE CONNECTIVITY; Component_Country_Of_Origin: China°; ShowFields: YES; ID: 5716; ComponentLink1URL: http://tunmcdsvn.tun.st.com/Component_Documentation_Library/Trunk/Connector/TE_CONNECTIVITY_2-1734592-2; Internal_Part_Number: MCD-03600; Value: 2-1734592-2; Status: New; Manufacturer_Part_Number: 2-1734592-2; Order_Code_Digikey: A101307TR-ND; Order_Code_Farnell: 3398660; Order_Code_RS: N/A
R251 = MCD-00417: Resistor, 200R, 0402, +/-1%, 1/16W; Manufacturer_Part_Number: RC0402FR-07200RL; Manufacturer: YAGEO; Part_Preference: Recommended; Component_Country_Of_Origin: China; ID: 2860; ShowFields: YES; Internal_Part_Number: MCD-00417; Status: Released; Part_Type: Resistor; Package: 0402; ComponentLink1URL: http://tunmcdsvn.tun.st.com/Component_Documentation_Library/Trunk/Resistor/YAGEO_RC_L_Series; Order_Code_Digikey: 311-200LRCT-ND; Order_Code_Farnell: 1458756; Order_Code_RS: N/A
U1 = MCD-03375: as U1 on sheet USB3; Value: STM32MP257FAK3; Internal_Part_Number: MCD-03375; Status: Checked; Manufacturer_Part_Number: STM32MP257FAK3; Package: TFBGA; ComponentLink1URL: http://tunmcdsvn.tun.st.com/Component_Documentation_Library/Trunk/IC/STMICROELECTRONICS_STM32MP257FAK3; Order_Code_Digikey: N/A; Order_Code_Farnell: N/A; Order_Code_RS: N/A
U11 U14 U19 U29 U31-U33 U39 = MCD-03501: ESD protection , 0201; Part_Type: IC; Part_Preference: Recommended; Manufacturer: STMICROELECTRONICS; ShowFields: YES; ID: 5617; Order_Code_RS: 163-7318; Internal_Part_Number: MCD-03501; Status: New; Manufacturer_Part_Number: ESDZL5-1F4; ComponentLink1URL: http://tunmcdsvn.tun.st.com/Component_Documentation_Library/Trunk/IC/STMICROELECTRONICS_ESDZL5-1F4; Order_Code_Digikey: 497-17544-2-ND; Order_Code_Farnell: ESDZL5-1F4; Package: 0201; Full_Alternate_Internal_Part_Number: N/A
U18 = MCD-03060: as U42 on sheet USB3; ComponentLink1Description: Datasheet; ComponentLink1URL: http://tunmcdsvn.tun.st.com/Component_Documentation_Library/Trunk/IC/STMICROELECTRONICS_ECMF4-40A100N10; Internal_Part_Number: MCD-03060; Value: ECMF2-40A100N6; Status: Checked; Manufacturer_Part_Number: ECMF2-40A100N6; Package: uQFN-6; Order_Code_Digikey: 497-ECMF2-40A100N6; Order_Code_Farnell: 3993603; Order_Code_RS: N/A
U21 = MCD-03059: ESD protection & Common Filter High Speed serial Interfaces , 0.4 pitch; Part_Type: IC; Part_Preference: Recommended; Manufacturer: STMICROELECTRONICS; ShowFields: YES; ID: 5175; Component_Country_Of_Origin: China; ComponentLink1Description: Datasheet; ComponentLink1URL: http://tunmcdsvn.tun.st.com/Component_Documentation_Library/Trunk/IC/STMICROELECTRONICS_ECMF4-40A100N10; Internal_Part_Number: MCD-03059; Value: ECMF4-40A100N10; Status: Checked; Manufacturer_Part_Number: ECMF4-40A100N10; Package: uQFN-10L; Order_Code_Digikey: 497-ECMF4-40A100N10; Order_Code_Farnell: N/A; Order_Code_RS: N/A

## Sheet AUDIO.SchDoc: AUDIO
size A4; Date: Not used; ApprovedBy: Not used; CheckedBy: Not used; Author: Not used; CompanyName: STMicroelectronics; DrawnBy: Not used; Engineer: Not used; Organization: Not used; Address1: Not used; Address2: Not used; Address3: Not used; Address4: Not used; DocumentNumber: Not used; Revision: Not used; SheetNumber: 15; SheetTotal: 18; CurrentTime: Not used; CurrentDate: Not used; Time: Not used; DocumentFullPathAndName: Not used; DocumentName: Not used; ModifiedDate: Not used; ImagePath: Not used; ProjectName: Not used; Application_BuildNumber: Not used
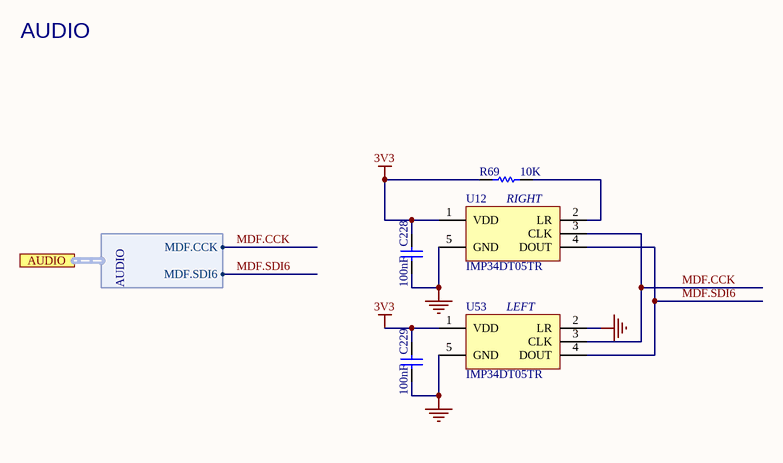
[diagram p12: AUDIO.SchDoc]

### Parts
C228  value 100nF  [C0402]
C229  value 100nF  [C0402]
R69  value 10K  [R0402]  (hidden comment: Resistor)
U12  IMP34DT05TR  [MIC_HCLGA_3X4X1_4LD]
U53  IMP34DT05TR  [MIC_HCLGA_3X4X1_4LD]

### Ports
AUDIO (harness AUDIO)

### Harnesses
AUDIO: MDF.CCK, MDF.SDI6

### Nets
3V3: C228.1 C229.1 R69.1 U12.1(VDD) U53.1(VDD)
GND: C228.2 C229.2 U12.5(GND) U53.2(LR) U53.5(GND)
MDF.CCK: U12.3(CLK) U53.3(CLK) ; port AUDIO.MDF.CCK
MDF.SDI6: U12.4(DOUT) U53.4(DOUT) ; port AUDIO.MDF.SDI6
NetR69_2: R69.2 U12.2(LR)

### Notes on the sheet
- AUDIO
- RIGHT
- (near U53) LEFT
- Title:
- Project:
- Size:
- Revision:
- Variant:
- A4
- -
- Date:
- Reference:
- Sheet:
- of

### Library data of the parts
C228 C229 = MCD-00006: Capacitor,100nF,16V,X7R,10%,0402; Manufacturer_Part_Number: CC0402KRX7R7BB104; Manufacturer: YAGEO; Alternate_Manufacturer: MURATA; Alternate_Manufacturer_Part_Number: GCM155R71C104KA55D; Part_Preference: Recommended; Partial_Alternate_Internal_Part_Number: MCD-03299; Provided_By: SUBCO; Initial_Board_Reference: mb1274; Order_Code_RS: 616-9701; Alternate_EMS: M; Component_Country_Of_Origin: China; ID: 2474; ShowFields: YES; Internal_Part_Number: MCD-00006; ComponentLink1Description: Datasheet; ECCN_US: n/a; ECCN_EU: n/a; Status: Released; Part_Type: Capacitor; Package: 0402; ComponentLink1URL: http://tunmcdsvn.tun.st.com/Component_Documentation_Library/Trunk/Capacitor/YAGEO_X7R_Series; Order_Code_Digikey: 311-1338-1-ND; Order_Code_Farnell: 9402047
R69 = MCD-00053: Resistor,10K,0402,1%,1/16W; BMS_Part_Number: 9131590; Part_Preference: Recommended; Manufacturer: YAGEO; Manufacturer_Part_Number: RC0402FR-0710KL; Component_Country_Of_Origin: China; ID: 2539; ShowFields: YES; Internal_Part_Number: MCD-00053; Status: Released; Part_Type: Resistor; Package: 0402; ComponentLink1Description: Datasheet; ComponentLink1URL: http://tunmcdsvn.tun.st.com/Component_Documentation_Library/Trunk/Resistor/YAGEO_RC_L_Series; Order_Code_Digikey: 311-10.0KLRCT-ND; Order_Code_Farnell: 9239359; Order_Code_RS: N/A
U12 U53 = MCD-01715: MEMS audio sensor omnidirectional digital microphone for industrial applications; BMS_Part_Number: 9177995; Part_Preference: Recommended; Part_Type: IC; Manufacturer: STMICROELECTRONICS; Manufacturer_HQ_COO: EU; Component_Country_Of_Origin: Philippines; ID: 3815; ShowFields: YES; Internal_Part_Number: MCD-01715; Value: IMP34DT05TR; Status: Released; Manufacturer_Part_Number: IMP34DT05TR; Package: HCLGA-4LD; ComponentLink1Description: Datasheet; ComponentLink1URL: http://tunmcdsvn.tun.st.com/Component_Documentation_Library/Trunk/IC/STMICROELECTRONICS_IMP34DT05TR; Order_Code_Digikey: N/A; Order_Code_Farnell: N/A; Order_Code_RS: N/A

## Sheet Expansion_Connector.SchDoc: EXPANSION_Connector
size A4; CompanyName: STMicroelectronics; Organization: Microcontrollers Division; Address1: 12, Rue Jules HOROWITZ; Address2: 38019 Grenoble; Address3: FRANCE; DocumentNumber: MB1272; Revision: A-01; SheetNumber: 16; SheetTotal: 18; Project: STM32MP15-DISCO PI; DocumentName: ARDUINO_ Connectors.SchDoc
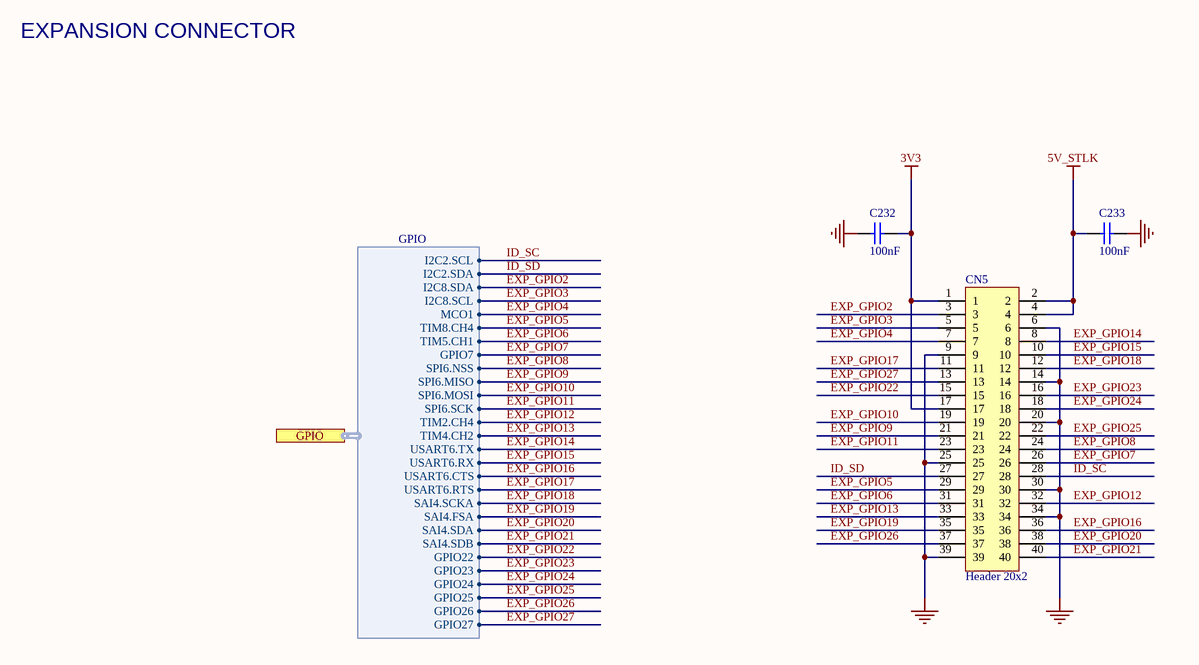
[diagram p13: Expansion_Connector.SchDoc]

### Parts
C232  value 100nF  [C0402]  (hidden comment: Capacitor)
C233  value 100nF  [C0402]  (hidden comment: Capacitor)
CN5  Header 20x2  [CON_SAMTEC_TSW-120-07-G-D]

### Ports
GPIO (harness GPIO)

### Harnesses
GPIO: I2C2.SCL, I2C2.SDA, I2C8.SDA, MCO1, TIM8.CH4, TIM5.CH1, GPIO7, SPI6.NSS, SPI6.MISO, SPI6.MOSI, SPI6.SCK, TIM2.CH4, TIM4.CH2, USART6.TX, USART6.RX, USART6.CTS, USART6.RTS, I2C8.SCL, SAI4.SCKA, SAI4.FSA, SAI4.SDA, SAI4.SDB, GPIO22, GPIO23, GPIO24, GPIO25, GPIO26, GPIO27

### Nets
3V3: C232.1 CN5.1 CN5.17
5V_STLK: C233.2 CN5.2 CN5.4
GND: C232.2 C233.1 CN5.6 CN5.9 CN5.14 CN5.20 CN5.25 CN5.30 CN5.34 CN5.39
EXP_GPIO2: CN5.3 ; port GPIO.I2C8.SDA
EXP_GPIO3: CN5.5 ; port GPIO.I2C8.SCL
EXP_GPIO4: CN5.7 ; port GPIO.MCO1
EXP_GPIO5: CN5.29 ; port GPIO.TIM8.CH4
EXP_GPIO6: CN5.31 ; port GPIO.TIM5.CH1
EXP_GPIO7: CN5.26 ; port GPIO.GPIO7
EXP_GPIO8: CN5.24 ; port GPIO.SPI6.NSS
EXP_GPIO9: CN5.21 ; port GPIO.SPI6.MISO
EXP_GPIO10: CN5.19 ; port GPIO.SPI6.MOSI
EXP_GPIO11: CN5.23 ; port GPIO.SPI6.SCK
EXP_GPIO12: CN5.32 ; port GPIO.TIM2.CH4
EXP_GPIO13: CN5.33 ; port GPIO.TIM4.CH2
EXP_GPIO14: CN5.8 ; port GPIO.USART6.TX
EXP_GPIO15: CN5.10 ; port GPIO.USART6.RX
EXP_GPIO16: CN5.36 ; port GPIO.USART6.CTS
EXP_GPIO17: CN5.11 ; port GPIO.USART6.RTS
EXP_GPIO18: CN5.12 ; port GPIO.SAI4.SCKA
EXP_GPIO19: CN5.35 ; port GPIO.SAI4.FSA
EXP_GPIO20: CN5.38 ; port GPIO.SAI4.SDA
EXP_GPIO21: CN5.40 ; port GPIO.SAI4.SDB
EXP_GPIO22: CN5.15 ; port GPIO.GPIO22
EXP_GPIO23: CN5.16 ; port GPIO.GPIO23
EXP_GPIO24: CN5.18 ; port GPIO.GPIO24
EXP_GPIO25: CN5.22 ; port GPIO.GPIO25
EXP_GPIO26: CN5.37 ; port GPIO.GPIO26
EXP_GPIO27: CN5.13 ; port GPIO.GPIO27
ID_SC: CN5.28 ; port GPIO.I2C2.SCL  [project net I2C2.SCL]
ID_SD: CN5.27 ; port GPIO.I2C2.SDA  [project net I2C2.SDA]

### Notes on the sheet
- EXPANSION CONNECTOR
- Title:
- Project:
- Size:
- Revision:
- Variant:
- A4
- -
- Date:
- Reference:
- Sheet:
- of

### Library data of the parts
C232 C233 = MCD-00006: Capacitor, MLCC, 100nF, 16V, X7R, +/-10%, 0402, T=0.5mm; Part_Preference: Recommended; Manufacturer: YAGEO; Manufacturer_Part_Number: CC0402KRX7R7BB104; Partial_Alternate_Internal_Part_Number: MCD-03299; Order_Code_RS: 616-9701; Component_Country_Of_Origin: China; ShowFields: YES; ID: 2474; Alternate_EMS: M; Internal_Part_Number: MCD-00006; Status: Released; Part_Type: Capacitor; Package: 0402; ComponentLink1URL: http://tunmcdsvn.tun.st.com/Component_Documentation_Library/Trunk/Capacitor/YAGEO_X7R_Series; Order_Code_Digikey: 311-1338-1-ND; Order_Code_Farnell: 9402047
CN5 = MCD-00302: Header, 20x2, 2.54mm, VR, TH, T=5.84mm/2.54mm; Manufacturer_Part_Number: TSW-120-07-G-D; Manufacturer: SAMTEC; Part_Type: Connector; Part_Preference: Recommended; Order_Code_RS: 180-2456; Component_Country_Of_Origin: China, Costa Rica, Malaysia, United States, Vietnam; ShowFields: YES; ID: 2567; Internal_Part_Number: MCD-00302; Value: Header 20x2; ComponentLink1URL: http://tunmcdsvn.tun.st.com/Component_Documentation_Library/Trunk/Connector/SAMTEC_TSW_Series/; Status: Released; Order_Code_Digikey: SAM1028-20-ND; Order_Code_Farnell: 2779689

## Sheet LPDDR4.SchDoc: LPDDR4
size A3; Date: Not used; ApprovedBy: Not used; CheckedBy: Not used; Author: Not used; CompanyName: STMicroelectronics; DrawnBy: Not used; Engineer: Not used; Organization: Not used; Address1: Not used; Address2: Not used; Address3: Not used; Address4: Not used; DocumentNumber: Not used; Revision: Not used; SheetNumber: 6; SheetTotal: 18; CurrentTime: Not used; CurrentDate: Not used; Time: Not used; DocumentFullPathAndName: Not used; DocumentName: Not used; ModifiedDate: Not used; ImagePath: Not used; ProjectName: Not used; Application_BuildNumber: Not used
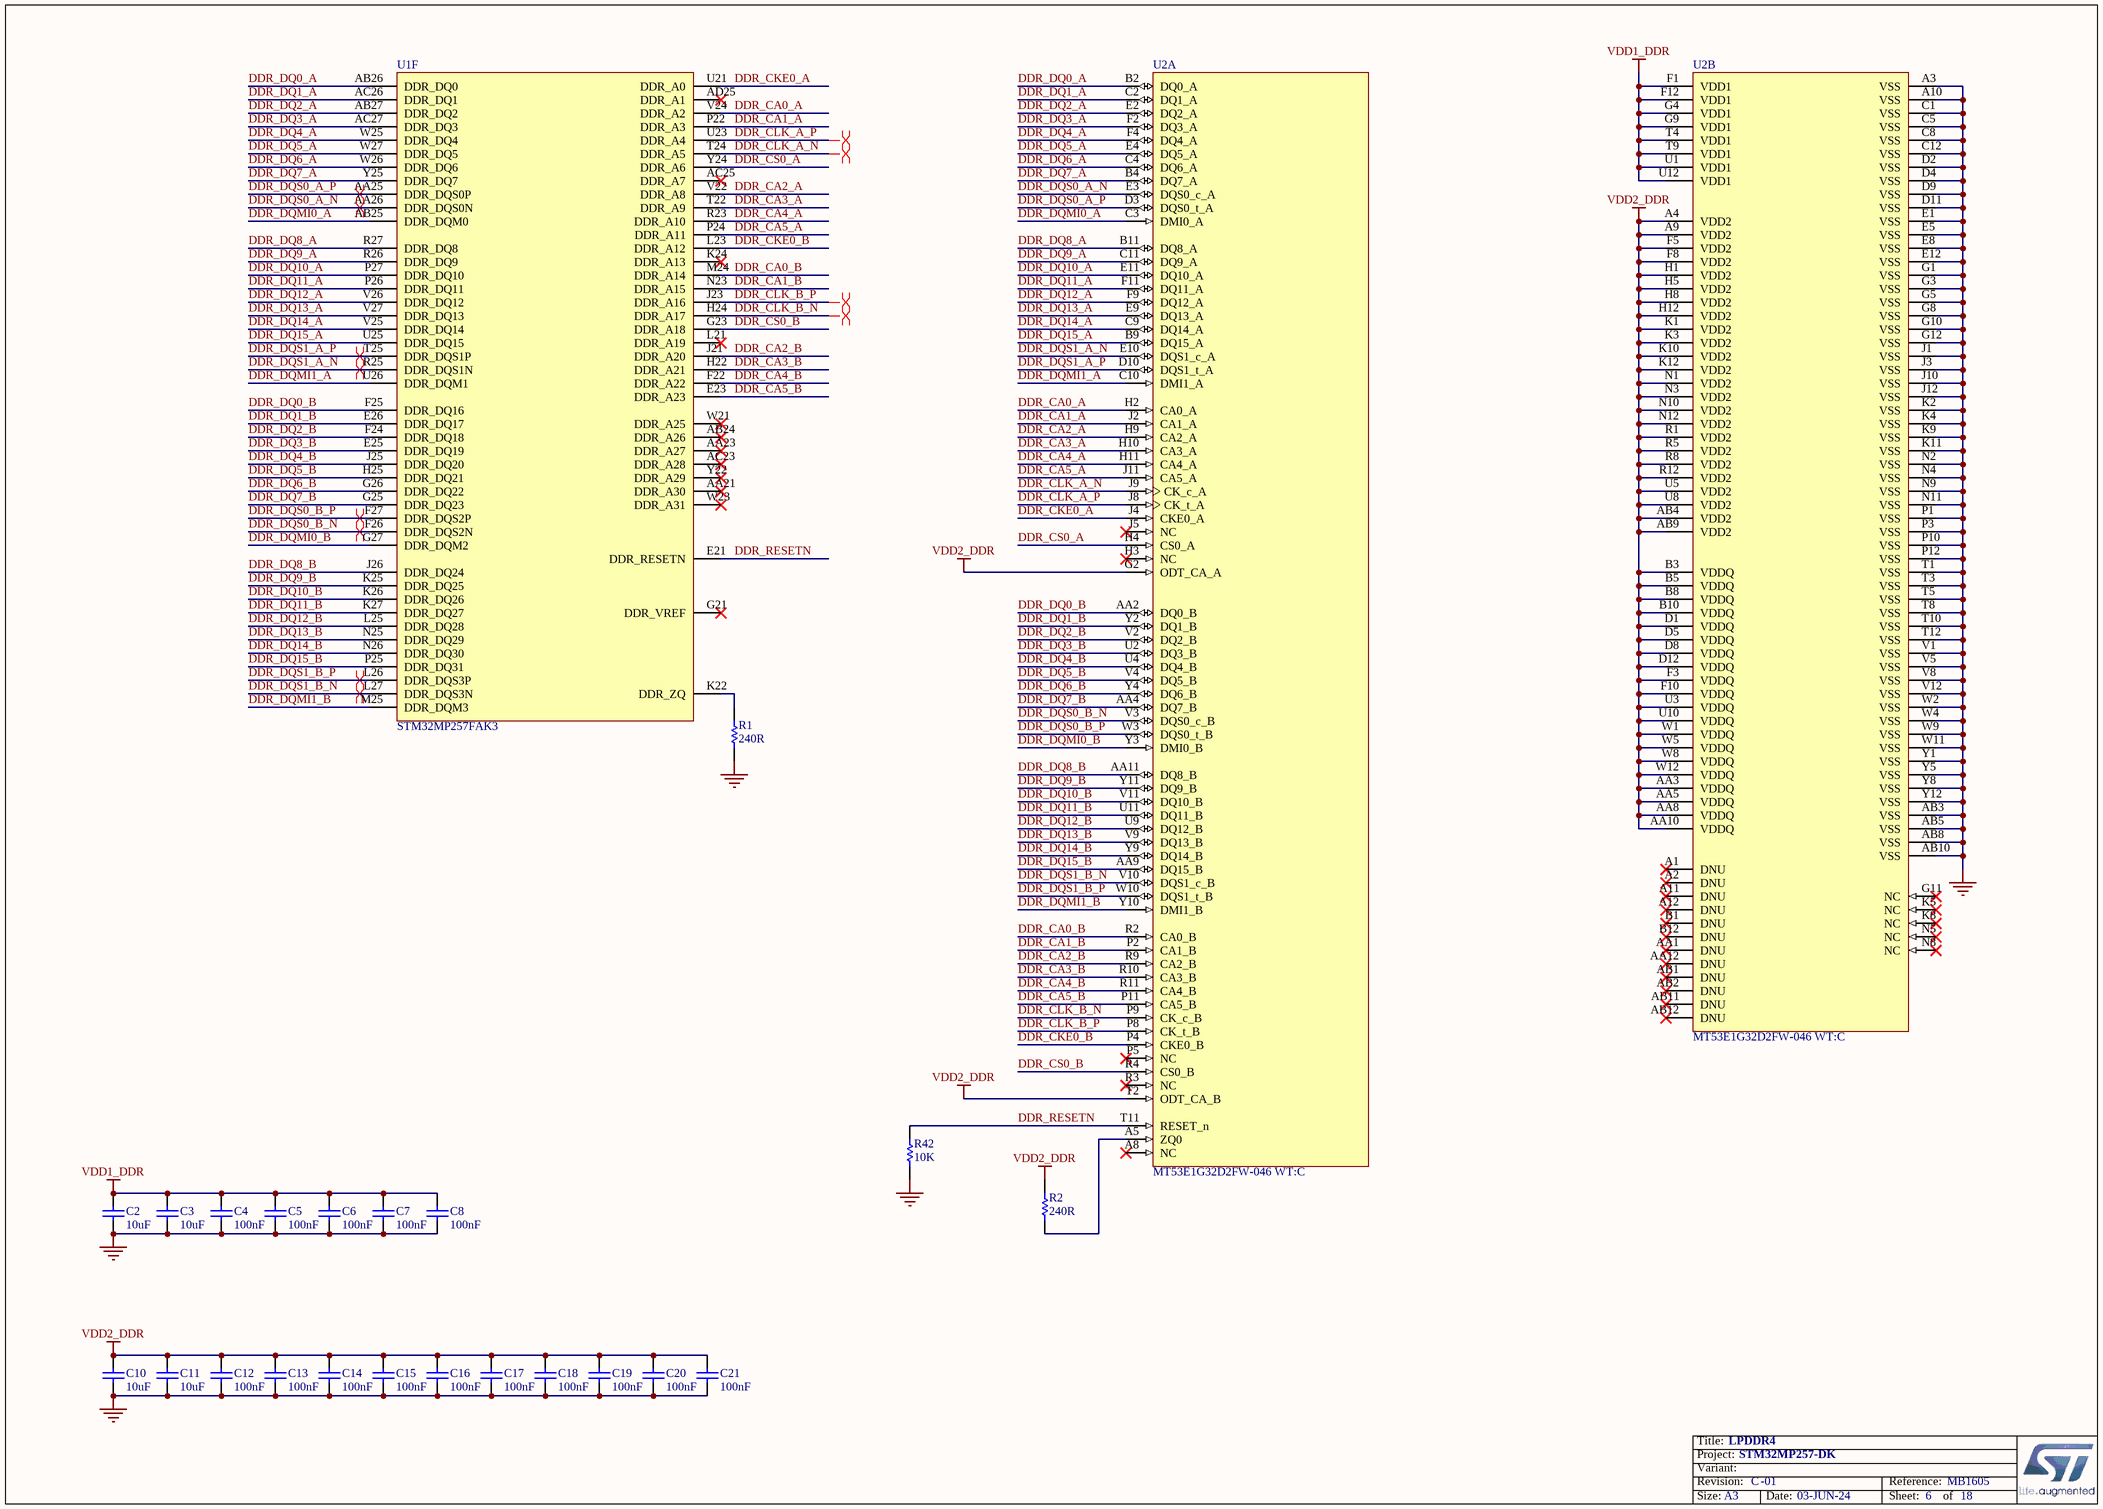
[diagram p14: LPDDR4.SchDoc]

### Parts
C2  value 10uF  [C0603]  (hidden comment: Capacitor)
C3  value 10uF  [C0603]  (hidden comment: Capacitor)
C4  100nF  [C0402]
C5  100nF  [C0402]
C6  100nF  [C0402]
C7  100nF  [C0402]
C8  100nF  [C0402]
C10  value 10uF  [C0603]  (hidden comment: Capacitor)
C11  value 10uF  [C0603]  (hidden comment: Capacitor)
C12  100nF  [C0402]
C13  100nF  [C0402]
C14  100nF  [C0402]
C15  100nF  [C0402]
C16  100nF  [C0402]
C17  100nF  [C0402]
C18  100nF  [C0402]
C19  100nF  [C0402]
C20  100nF  [C0402]
C21  100nF  [C0402]
R1  value 240R  [R0201_H0P23]  (hidden comment: Resistor)
R2  value 240R  [R0201_H0P23]  (hidden comment: Resistor)
R42  value 10K  [R0402]  (hidden comment: Resistor)
U1  STM32MP257FAK3  [ICC_TFBGA424_14X14_P050_H1P20_CODE-B0A2]  (part F of 9)
U2  MT53E1G32D2FW-046 WT:C  [ICC_TFBGA200_10X14P5_P080_H1P05_PS0P3]  (parts A,B of 2)

### Nets
GND: C2.1 C3.1 C4.2 C5.2 C6.2 C7.2 C8.2 C10.1 C11.1 C12.2 C13.2 C14.2 C15.2 C16.2 C17.2 C18.2 C19.2 C20.2 C21.2 R1.1 R42.1 U2.A3(VSS) U2.A10(VSS) U2.AB3(VSS) U2.AB5(VSS) U2.AB8(VSS) U2.AB10(VSS) U2.C1(VSS) U2.C5(VSS) U2.C8(VSS) U2.C12(VSS) U2.D2(VSS) U2.D4(VSS) U2.D9(VSS) U2.D11(VSS) U2.E1(VSS) U2.E5(VSS) U2.E8(VSS) U2.E12(VSS) U2.G1(VSS) U2.G3(VSS) U2.G5(VSS) U2.G8(VSS) U2.G10(VSS) U2.G12(VSS) U2.J1(VSS) U2.J3(VSS) U2.J10(VSS) U2.J12(VSS) U2.K2(VSS) U2.K4(VSS) U2.K9(VSS) U2.K11(VSS) U2.N2(VSS) U2.N4(VSS) U2.N9(VSS) U2.N11(VSS) U2.P1(VSS) U2.P3(VSS) U2.P10(VSS) U2.P12(VSS) U2.T1(VSS) U2.T3(VSS) U2.T5(VSS) U2.T8(VSS) U2.T10(VSS) U2.T12(VSS) U2.V1(VSS) U2.V5(VSS) U2.V8(VSS) U2.V12(VSS) U2.W2(VSS) U2.W4(VSS) U2.W9(VSS) U2.W11(VSS) U2.Y1(VSS) U2.Y5(VSS) U2.Y8(VSS) U2.Y12(VSS)
VDD1_DDR: C2.2 C3.2 C4.1 C5.1 C6.1 C7.1 C8.1 U2.F1(VDD1) U2.F12(VDD1) U2.G4(VDD1) U2.G9(VDD1) U2.T4(VDD1) U2.T9(VDD1) U2.U1(VDD1) U2.U12(VDD1)
VDD2_DDR: C10.2 C11.2 C12.1 C13.1 C14.1 C15.1 C16.1 C17.1 C18.1 C19.1 C20.1 C21.1 R2.2 U2.A4(VDD2) U2.A9(VDD2) U2.AA3(VDDQ) U2.AA5(VDDQ) U2.AA8(VDDQ) U2.AA10(VDDQ) U2.AB4(VDD2) U2.AB9(VDD2) U2.B3(VDDQ) U2.B5(VDDQ) U2.B8(VDDQ) U2.B10(VDDQ) U2.D1(VDDQ) U2.D5(VDDQ) U2.D8(VDDQ) U2.D12(VDDQ) U2.F3(VDDQ) U2.F5(VDD2) U2.F8(VDD2) U2.F10(VDDQ) U2.G2(ODT_CA_A) U2.H1(VDD2) U2.H5(VDD2) U2.H8(VDD2) U2.H12(VDD2) U2.K1(VDD2) U2.K3(VDD2) U2.K10(VDD2) U2.K12(VDD2) U2.N1(VDD2) U2.N3(VDD2) U2.N10(VDD2) U2.N12(VDD2) U2.R1(VDD2) U2.R5(VDD2) U2.R8(VDD2) U2.R12(VDD2) U2.T2(ODT_CA_B) U2.U3(VDDQ) U2.U5(VDD2) U2.U8(VDD2) U2.U10(VDDQ) U2.W1(VDDQ) U2.W5(VDDQ) U2.W8(VDDQ) U2.W12(VDDQ)
DDR_CA0_A: U1.V24(DDR_A2) U2.H2(CA0_A)
DDR_CA0_B: U1.M24(DDR_A14) U2.R2(CA0_B)
DDR_CA1_A: U1.P22(DDR_A3) U2.J2(CA1_A)
DDR_CA1_B: U1.N23(DDR_A15) U2.P2(CA1_B)
DDR_CA2_A: U1.V22(DDR_A8) U2.H9(CA2_A)
DDR_CA2_B: U1.J21(DDR_A20) U2.R9(CA2_B)
DDR_CA3_A: U1.T22(DDR_A9) U2.H10(CA3_A)
DDR_CA3_B: U1.H22(DDR_A21) U2.R10(CA3_B)
DDR_CA4_A: U1.R23(DDR_A10) U2.H11(CA4_A)
DDR_CA4_B: U1.F22(DDR_A22) U2.R11(CA4_B)
DDR_CA5_A: U1.P24(DDR_A11) U2.J11(CA5_A)
DDR_CA5_B: U1.E23(DDR_A23) U2.P11(CA5_B)
DDR_CKE0_A: U1.U21(DDR_A0) U2.J4(CKE0_A)
DDR_CKE0_B: U1.L23(DDR_A12) U2.P4(CKE0_B)
DDR_CLK_A_N: U1.T24(DDR_A5) U2.J9(CK_c_A)
DDR_CLK_A_P: U1.U23(DDR_A4) U2.J8(CK_t_A)
DDR_CLK_B_N: U1.H24(DDR_A17) U2.P9(CK_c_B)
DDR_CLK_B_P: U1.J23(DDR_A16) U2.P8(CK_t_B)
DDR_CS0_A: U1.Y24(DDR_A6) U2.H4(CS0_A)
DDR_CS0_B: U1.G23(DDR_A18) U2.R4(CS0_B)
DDR_DQ0_A: U1.AB26(DDR_DQ0) U2.B2(DQ0_A)
DDR_DQ0_B: U1.F25(DDR_DQ16) U2.AA2(DQ0_B)
DDR_DQ1_A: U1.AC26(DDR_DQ1) U2.C2(DQ1_A)
DDR_DQ1_B: U1.E26(DDR_DQ17) U2.Y2(DQ1_B)
DDR_DQ2_A: U1.AB27(DDR_DQ2) U2.E2(DQ2_A)
DDR_DQ2_B: U1.F24(DDR_DQ18) U2.V2(DQ2_B)
DDR_DQ3_A: U1.AC27(DDR_DQ3) U2.F2(DQ3_A)
DDR_DQ3_B: U1.E25(DDR_DQ19) U2.U2(DQ3_B)
DDR_DQ4_A: U1.W25(DDR_DQ4) U2.F4(DQ4_A)
DDR_DQ4_B: U1.J25(DDR_DQ20) U2.U4(DQ4_B)
DDR_DQ5_A: U1.W27(DDR_DQ5) U2.E4(DQ5_A)
DDR_DQ5_B: U1.H25(DDR_DQ21) U2.V4(DQ5_B)
DDR_DQ6_A: U1.W26(DDR_DQ6) U2.C4(DQ6_A)
DDR_DQ6_B: U1.G26(DDR_DQ22) U2.Y4(DQ6_B)
DDR_DQ7_A: U1.Y25(DDR_DQ7) U2.B4(DQ7_A)
DDR_DQ7_B: U1.G25(DDR_DQ23) U2.AA4(DQ7_B)
DDR_DQ8_A: U1.R27(DDR_DQ8) U2.B11(DQ8_A)
DDR_DQ8_B: U1.J26(DDR_DQ24) U2.AA11(DQ8_B)
DDR_DQ9_A: U1.R26(DDR_DQ9) U2.C11(DQ9_A)
DDR_DQ9_B: U1.K25(DDR_DQ25) U2.Y11(DQ9_B)
DDR_DQ10_A: U1.P27(DDR_DQ10) U2.E11(DQ10_A)
DDR_DQ10_B: U1.K26(DDR_DQ26) U2.V11(DQ10_B)
DDR_DQ11_A: U1.P26(DDR_DQ11) U2.F11(DQ11_A)
DDR_DQ11_B: U1.K27(DDR_DQ27) U2.U11(DQ11_B)
DDR_DQ12_A: U1.V26(DDR_DQ12) U2.F9(DQ12_A)
DDR_DQ12_B: U1.L25(DDR_DQ28) U2.U9(DQ12_B)
DDR_DQ13_A: U1.V27(DDR_DQ13) U2.E9(DQ13_A)
DDR_DQ13_B: U1.N25(DDR_DQ29) U2.V9(DQ13_B)
DDR_DQ14_A: U1.V25(DDR_DQ14) U2.C9(DQ14_A)
DDR_DQ14_B: U1.N26(DDR_DQ30) U2.Y9(DQ14_B)
DDR_DQ15_A: U1.U25(DDR_DQ15) U2.B9(DQ15_A)
DDR_DQ15_B: U1.P25(DDR_DQ31) U2.AA9(DQ15_B)
DDR_DQMI0_A: U1.AB25(DDR_DQM0) U2.C3(DMI0_A)
DDR_DQMI0_B: U1.G27(DDR_DQM2) U2.Y3(DMI0_B)
DDR_DQMI1_A: U1.U26(DDR_DQM1) U2.C10(DMI1_A)
DDR_DQMI1_B: U1.M25(DDR_DQM3) U2.Y10(DMI1_B)
DDR_DQS0_A_N: U1.AA26(DDR_DQS0N) U2.E3(DQS0_c_A)
DDR_DQS0_A_P: U1.AA25(DDR_DQS0P) U2.D3(DQS0_t_A)
DDR_DQS0_B_N: U1.F26(DDR_DQS2N) U2.V3(DQS0_c_B)
DDR_DQS0_B_P: U1.F27(DDR_DQS2P) U2.W3(DQS0_t_B)
DDR_DQS1_A_N: U1.R25(DDR_DQS1N) U2.E10(DQS1_c_A)
DDR_DQS1_A_P: U1.T25(DDR_DQS1P) U2.D10(DQS1_t_A)
DDR_DQS1_B_N: U1.L27(DDR_DQS3N) U2.V10(DQS1_c_B)
DDR_DQS1_B_P: U1.L26(DDR_DQS3P) U2.W10(DQS1_t_B)
DDR_RESETN: R42.2 U1.E21(DDR_RESETN) U2.T11(RESET_n)
NetR1_2: R1.2 U1.K22(DDR_ZQ)
NetR2_1: R2.1 U2.A5(ZQ0)

Not connected (* = marked no-connect by the designer): U1 AA21(DDR_A30)* AA23(DDR_A27)* AB24(DDR_A26)* AC23(DDR_A28)* AC25(DDR_A7)* AD25(DDR_A1)* G21(DDR_VREF)* K24(DDR_A13)* L21(DDR_A19)* W21(DDR_A25)* W23(DDR_A31)* Y22(DDR_A29)*; U2 A1(DNU)* A2(DNU)* A8(NC)* A11(DNU)* A12(DNU)* AA1(DNU)* AA12(DNU)* AB1(DNU)* AB2(DNU)* AB11(DNU)* AB12(DNU)* B1(DNU)* B12(DNU)* G11(NC)* H3(NC)* J5(NC)* K5(NC)* K8(NC)* N5(NC)* N8(NC)* P5(NC)* R3(NC)*

### Layout directives
differential pair: DDR_CLK_A_N, DDR_CLK_A_P, DDR_CLK_B_N, DDR_CLK_B_P, DDR_DQS0_A_N, DDR_DQS0_A_P, DDR_DQS0_B_N, DDR_DQS0_B_P, DDR_DQS1_A_N, DDR_DQS1_A_P, DDR_DQS1_B_N, DDR_DQS1_B_P

### Notes on the sheet
- Title:
- Project:
- Size:
- Revision:
- Variant:
- A3
- -
- Date:
- Reference:
- Sheet:
- of

### Library data of the parts
C2 C3 C10 C11 = MCD-01341: Capacitor, MLCC, 10uF, 6V3, X5R, 20%, 0603, T=0,8mm; Manufacturer_Part_Number: GRM188R60J106ME47D; Manufacturer: MURATA; Alternate_Manufacturer_Part_Number: GRM188R60J106ME84D; Part_Preference: Recommended; ECCN_US: EAR99; ECCN_EU: NEC; Provided_By: SUBCO; Component_Country_Of_Origin: Japan; ID: 3441; ShowFields: YES; Internal_Part_Number: MCD-01341; Status: Released; Part_Type: Capacitor; Alternate_Manufacturer: MURATA; Package: 0603; ComponentLink1Description: Datasheet; ComponentLink1URL: http://tunmcdsvn.tun.st.com/Component_Documentation_Library/Trunk/Capacitor/MURATA_GRM_Series; Order_Code_Digikey: 490-3896-1-ND; Order_Code_Farnell: 1735528; Order_Code_RS: N/A
C4-C8 C12-C21 = MCD-00006: Capacitor, MLCC, 100nF, 16V, X7R, +/-10%, 0402, T=0.5mm; Part_Preference: Recommended; Manufacturer: YAGEO; Manufacturer_Part_Number: CC0402KRX7R7BB104; Partial_Alternate_Internal_Part_Number: MCD-03299; Order_Code_RS: 616-9701; Component_Country_Of_Origin: China; Alternate_EMS: M; ShowFields: YES; ID: 2474; Value: 100nF; Internal_Part_Number: MCD-00006; Status: Released; Part_Type: Capacitor; Package: 0402; ComponentLink1URL: http://tunmcdsvn.tun.st.com/Component_Documentation_Library/Trunk/Capacitor/YAGEO_X7R_Series; Order_Code_Digikey: 311-1338-1-ND; Order_Code_Farnell: 9402047
R1 R2 = MCD-02253: Resistor, 240R, 0201, +/-1%, 1/20W; Part_Preference: Recommended; Manufacturer: YAGEO; Manufacturer_Part_Number: RC0201FR-07240RL; Component_Country_Of_Origin: China; ID: 4353; ShowFields: YES; Internal_Part_Number: MCD-02253; Status: Checked; Part_Type: Resistor; Alternate_Manufacturer: N/A; Alternate_Manufacturer_Part_Number: N/A; Package: 0201; ComponentLink1URL: http://tunmcdsvn.tun.st.com/Component_Datasheet_Library/Trunk/Resistors/Yageo_Resistor_RC0201-series; Order_Code_Digikey: YAG2528CT-ND; Order_Code_Farnell: N/A; Order_Code_RS: N/A
R42 = MCD-00053: as R220 on sheet USB3; Internal_Part_Number: MCD-00053; Status: Released; Part_Type: Resistor; Alternate_Manufacturer: N/A; Alternate_Manufacturer_Part_Number: N/A; Package: 0402; ComponentLink1URL: http://tunmcdsvn.tun.st.com/Component_Documentation_Library/Trunk/Resistor/YAGEO_RC_L_Series; Order_Code_Digikey: 311-10.0KLRCT-ND; Order_Code_Farnell: 9239359; Order_Code_RS: N/A
U1 = MCD-03375: as U1 on sheet USB3; Value: STM32MP257FAK3; Internal_Part_Number: MCD-03375; Status: Checked; Manufacturer_Part_Number: STM32MP257FAK3; Package: TFBGA; ComponentLink1URL: http://tunmcdsvn.tun.st.com/Component_Documentation_Library/Trunk/IC/STMICROELECTRONICS_STM32MP257FAK3; Order_Code_Digikey: N/A; Order_Code_Farnell: N/A; Order_Code_RS: N/A
U2 = MCD-04160: Memory, LPDDR4 SDRAM,1V8, 32Gbit, 2133MHz; Part_Type: IC; Part_Preference: Recommended; Manufacturer: MICRON; ShowFields: YES; ID: 6276; Internal_Part_Number: MCD-04160; Value: MT53E1G32D2FW-046 WT:C; Status: New; Manufacturer_Part_Number: MT53E1G32D2FW-046 WT:C; Package: TFBGA-200; ComponentLink1URL: http://tunmcdsvn.tun.st.com/Component_Documentation_Library/Trunk/IC/MICRON_MT53E1G32D2FW-046-WT-C; Order_Code_Digikey: 557-MT53E1G32D2FW-046WT:C-ND; Order_Code_Farnell: N/A; Order_Code_RS: N/A